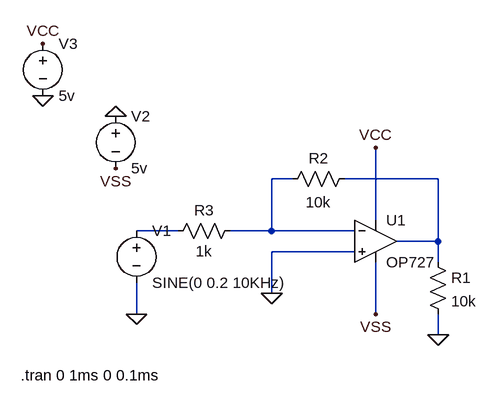
[diagram p0: schematic 6432085221-PB2.asc]
6432085221-PB2.asc, the LTspice schematic file:
Version 4
SHEET 1 880 680
WIRE 304 304 272 304
WIRE 528 304 384 304
WIRE 432 368 432 256
WIRE 128 384 64 384
WIRE 272 384 272 304
WIRE 272 384 208 384
WIRE 400 384 272 384
WIRE 528 400 528 304
WIRE 528 400 464 400
WIRE 400 416 272 416
WIRE 528 432 528 400
WIRE 272 480 272 416
WIRE 64 512 64 464
WIRE 432 512 432 432
WIRE 528 544 528 512
FLAG 272 480 0
FLAG 64 512 0
FLAG 432 256 VCC
FLAG -80 96 VCC
FLAG 432 512 VSS
FLAG 32 288 VSS
FLAG 32 208 0
FLAG -80 176 0
FLAG 528 544 0
SYMBOL voltage 64 368 R0
WINDOW 123 0 0 Left 0
WINDOW 39 0 0 Left 0
SYMATTR InstName V1
SYMATTR Value SINE(0 0.2 10KHz)
SYMBOL OpAmps\\OP727 432 336 R0
SYMATTR InstName U1
SYMBOL voltage 32 192 R0
WINDOW 123 0 0 Left 0
WINDOW 39 0 0 Left 0
SYMATTR InstName V2
SYMATTR Value 5v
SYMBOL voltage -80 80 R0
WINDOW 123 0 0 Left 0
WINDOW 39 0 0 Left 0
SYMATTR InstName V3
SYMATTR Value 5v
SYMBOL res 512 416 R0
SYMATTR InstName R1
SYMATTR Value 10k
SYMBOL res 400 288 R90
WINDOW 0 0 56 VBottom 2
WINDOW 3 36 56 VTop 2
SYMATTR InstName R2
SYMATTR Value 10k
SYMBOL res 224 368 R90
WINDOW 0 0 56 VBottom 2
WINDOW 3 32 56 VTop 2
SYMATTR InstName R3
SYMATTR Value 1k
TEXT -114 606 Left 2 !.tran 0 1ms 0 0.1ms

The netlist it stands for:
* 6432085221-PB2.asc
V1 N003 0 SINE(0 0.2 10KHz)
XU1 0 N001 VCC VSS N002 OP727  ; pins In+ In- V+ V- OUT
V2 0 VSS 5v
V3 VCC 0 5v
R1 N002 0 10k
R2 N002 N001 10k
R3 N001 N003 1k
.tran 0 1ms 0 0.1ms
.backanno
.end